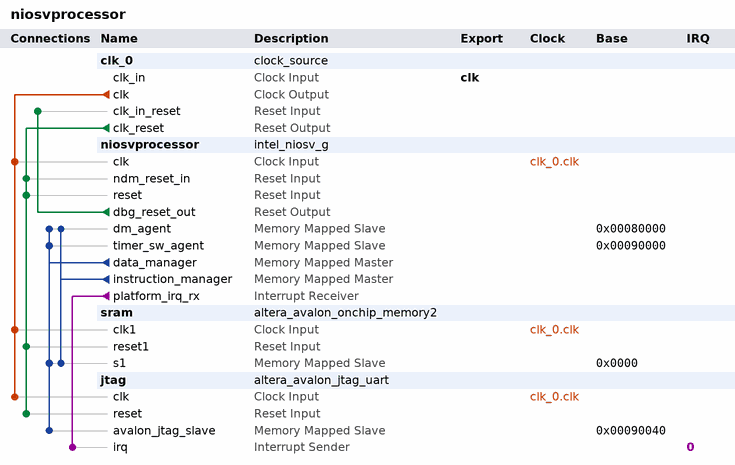
[diagram p0: system contents]
# Platform Designer (Qsys) system niosvprocessor, Cyclone V 5CSEBA6U23I7
# Parameters at their usual value, and those the tool derives, are not listed.
package require -exact qsys 23.1
create_system niosvprocessor
set_project_property DEVICE_FAMILY {Cyclone V}
set_project_property DEVICE 5CSEBA6U23I7

add_instance clk_0 clock_source 23.1
set_instance_parameter_value clk_0 clockFrequency 50000000

add_instance niosvprocessor intel_niosv_g 1.0.0
set_instance_parameter_value niosvprocessor clockFrequency 50000000
set_instance_parameter_value niosvprocessor dataCacheSize 4096
set_instance_parameter_value niosvprocessor dtcm1Base 0
set_instance_parameter_value niosvprocessor dtcm1Size 0
set_instance_parameter_value niosvprocessor dtcm2Base 0
set_instance_parameter_value niosvprocessor dtcm2Size 0
set_instance_parameter_value niosvprocessor enableDebug true
set_instance_parameter_value niosvprocessor enableDebugReset true
set_instance_parameter_value niosvprocessor enableECCLite false
set_instance_parameter_value niosvprocessor enableFPU false
set_instance_parameter_value niosvprocessor enableMulDiv true
set_instance_parameter_value niosvprocessor instCacheSize 4096
set_instance_parameter_value niosvprocessor itcm1Base 0
set_instance_parameter_value niosvprocessor itcm1Size 0
set_instance_parameter_value niosvprocessor itcm2Base 0
set_instance_parameter_value niosvprocessor itcm2Size 0
set_instance_parameter_value niosvprocessor peripheralRegionABase 0
set_instance_parameter_value niosvprocessor peripheralRegionASize 0
set_instance_parameter_value niosvprocessor peripheralRegionBBase 0
set_instance_parameter_value niosvprocessor peripheralRegionBSize 0
set_instance_parameter_value niosvprocessor resetOffset 0
set_instance_parameter_value niosvprocessor resetSlave sram.s1
set_instance_parameter_value niosvprocessor useResetReq false

add_instance sram altera_avalon_onchip_memory2 23.1
set_instance_parameter_value sram dataWidth 32
set_instance_parameter_value sram dualPort false
set_instance_parameter_value sram initMemContent true
set_instance_parameter_value sram initializationFileName onchip_mem.hex
set_instance_parameter_value sram memorySize 500000

add_instance jtag altera_avalon_jtag_uart 23.1
set_instance_parameter_value jtag simInteractiveOptions NO_INTERACTIVE_WINDOWS

# connections
add_connection clk_0.clk jtag.clk clock
add_connection clk_0.clk niosvprocessor.clk clock
add_connection clk_0.clk sram.clk1 clock
add_connection clk_0.clk_reset jtag.reset reset
add_connection clk_0.clk_reset niosvprocessor.ndm_reset_in reset
add_connection clk_0.clk_reset niosvprocessor.reset reset
add_connection clk_0.clk_reset sram.reset1 reset
add_connection niosvprocessor.dbg_reset_out clk_0.clk_in_reset reset
add_connection niosvprocessor.data_manager jtag.avalon_jtag_slave avalon
set_connection_parameter_value niosvprocessor.data_manager/jtag.avalon_jtag_slave baseAddress 0x00090040
add_connection niosvprocessor.data_manager niosvprocessor.dm_agent avalon
set_connection_parameter_value niosvprocessor.data_manager/niosvprocessor.dm_agent baseAddress 0x00080000
add_connection niosvprocessor.data_manager niosvprocessor.timer_sw_agent avalon
set_connection_parameter_value niosvprocessor.data_manager/niosvprocessor.timer_sw_agent baseAddress 0x00090000
add_connection niosvprocessor.data_manager sram.s1 avalon
set_connection_parameter_value niosvprocessor.data_manager/sram.s1 baseAddress 0x0000
add_connection niosvprocessor.instruction_manager niosvprocessor.dm_agent avalon
set_connection_parameter_value niosvprocessor.instruction_manager/niosvprocessor.dm_agent baseAddress 0x00080000
add_connection niosvprocessor.instruction_manager sram.s1 avalon
set_connection_parameter_value niosvprocessor.instruction_manager/sram.s1 baseAddress 0x0000
add_connection niosvprocessor.platform_irq_rx jtag.irq interrupt
set_connection_parameter_value niosvprocessor.platform_irq_rx/jtag.irq irqNumber 0

# exported interfaces
add_interface clk clock sink
set_interface_property clk EXPORT_OF clk_0.clk_in

set_interconnect_requirement {$system} qsys_mm.clockCrossingAdapter HANDSHAKE
set_interconnect_requirement {$system} qsys_mm.enableEccProtection FALSE
set_interconnect_requirement {$system} qsys_mm.insertDefaultSlave FALSE
set_interconnect_requirement {$system} qsys_mm.maxAdditionalLatency 1

save_system niosvprocessor.qsys
